# Altium schematic sheet Roseta_Battery.SchDoc
size A4
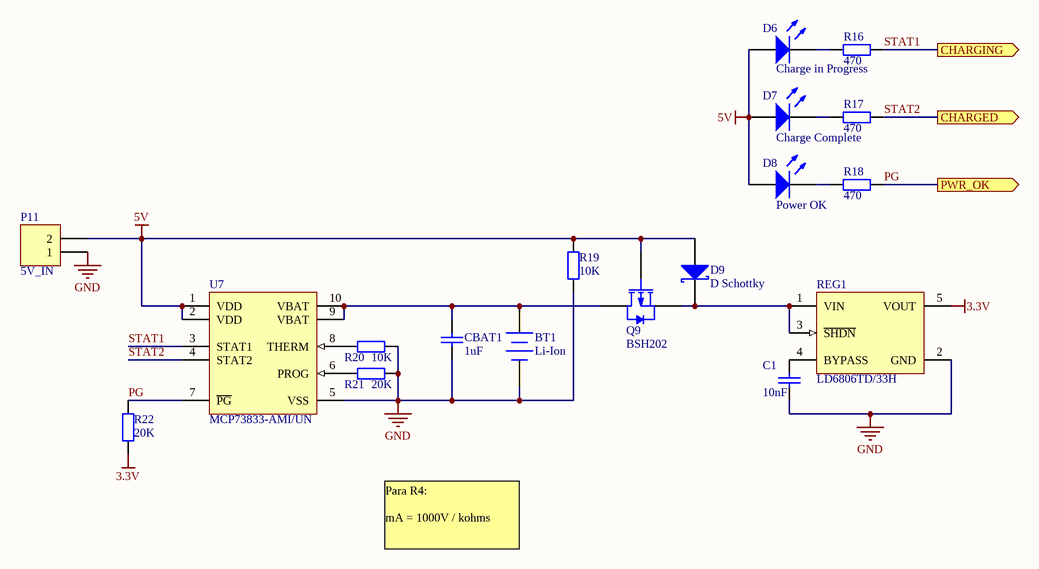
[diagram p0: Roseta_Battery.SchDoc]

## Parts
BT1  Li-Ion  [BAT-2]
C1  value 10nF  [1608[0603]]  (hidden comment: Cap)
CBAT1  value 1uF  [1608[0603]]  (hidden comment: Cap)
D6  Charge in Progress  [2013[0805]]
D7  Charge Complete  [2013[0805]]
D8  Power OK  [2013[0805]]
D9  D Schottky  [SOD123/X.85]
P11  5V_IN  [HDR1X2]
Q9  BSH202  [SOT95P240-3M]
R16  value 470  [1608[0603]]  (hidden comment: Res2)
R17  value 470  [1608[0603]]  (hidden comment: Res2)
R18  value 470  [1608[0603]]  (hidden comment: Res2)
R19  value 10K  [1608[0603]]  (hidden comment: Res2)
R20  value 10K  [1608[0603]]  (hidden comment: Res2)
R21  value 20K  [1608[0603]]  (hidden comment: Res2)
R22  value 20K  [1608[0603]]  (hidden comment: Res2)
REG1  LD6806TD/33H  [SOT-23-OT5_N]
U7  MCP73833-AMI/UN  [MSOP-UN10_N]

## Ports
CHARGED (out), CHARGING (out), PWR_OK (out)

## Nets
3.3V: R22.2 REG1.5(VOUT)
5V: D6.1 D7.1 D8.1 D9.1(A) P11.2 Q9.1(G) R19.1 U7.1(VDD) U7.2(VDD)
GND: BT1.2(-) C1.1 CBAT1.2 P11.1 R19.2 R20.1 R21.1 REG1.2(GND) U7.5(VSS)
PG: R18.2 R22.1 U7.7(~{PG}) ; port PWR_OK
STAT1: R16.2 U7.3(STAT1) ; port CHARGING
STAT2: R17.2 U7.4(STAT2) ; port CHARGED
NetBT1_1: BT1.1(+) CBAT1.1 Q9.3(D) U7.9(VBAT) U7.10(VBAT)
NetC1_2: C1.2 REG1.4(BYPASS)
NetD6_2: D6.2 R16.1
NetD7_2: D7.2 R17.1
NetD8_2: D8.2 R18.1
NetD9_2: D9.2(K) Q9.2(S) REG1.1(VIN) REG1.3(~{SHDN})
NetR20_2: R20.2 U7.8(THERM)
NetR21_2: R21.2 U7.6(PROG)

## Notes on the sheet
- Para R4:
  mA = 1000V / kohms

## Library data of the parts
BT1 = Battery: Multicell Battery; Published: 24-Mar-1999; LatestRevisionDate: 17-Jul-2002; LatestRevisionNote: Re-released for DXP Platform.; PackageReference: BAT-2; Publisher: Altium Limited
C1 CBAT1 = Cap: Capacitor; Published: 8-Jun-2000; LatestRevisionDate: 17-Jul-2002; LatestRevisionNote: Re-released for DXP Platform.; PackageReference: RAD-0.3; Publisher: Altium Limited
D6-D8 = LED SMD (0603)
D9 = D Schottky: Schottky Diode; Published: 8-Jun-2000; LatestRevisionDate: 17-Jul-2002; LatestRevisionNote: Re-released for DXP Platform.; PackageReference: SMB; Publisher: Altium Limited; Code_JEDEC: DO-214-AA
P11 = Header 2: Header, 2-Pin; LatestRevisionDate: 17-Jul-2002; LatestRevisionNote: Re-released for DXP Platform.; Publisher: Altium Limited
Q9 = BSH202: P-channel Enhancement Mode MOSFET; Published: 17-Sep-2003; LatestRevisionDate: 12-Dec-2006; LatestRevisionNote: IPC-7351 Footprint Added.; DatasheetVersion: Aug-1998; PackageVersion: May-1999; PackageReference: SOT23; Publisher: Altium Limited; PackageDescription: 3-Pin SOT-23 Package 0.95 mm Pitch, 2.3 mm Lead Span; ComponentLink1Description: Manufacturer Link; ComponentLink1URL: http://www.semiconductors.philips.com/; ComponentLink2Description: Datasheet; ComponentLink2URL: http://www.semiconductors.philips.com/acrobat/datasheets/BSH202_3.pdf
R16-R22 = Res2: Resistor; Published: 8-Jun-2000; LatestRevisionDate: 17-Jul-2002; LatestRevisionNote: Re-released for DXP Platform.; PackageReference: AXIAL-0.4; Publisher: Altium Limited
REG1 = TC1014-1.8VCT713: 50 mA, 100 mA and 150 mA CMOS LDOs with Active-Low Shutdown and Reference Bypass, 5-Pin SOT-23, Extended Temperature, Tape and Reel; FirstPublished: 29-Jan-2009; DatasheetVersion: revE, Feb-2007; PackageVersion: revBB, Aug-2009; PackageReference: SOT-23-CT5; Publisher: Altium Limited; PackageDescription: 5-Lead Plastic Small Outline Transistor (CT) [SOT-23]; Supplier 1: Digi-Key; Supplier Part Number 1: TC10141.8VCT713TR-ND; Supplier 2: Digi-Key; Supplier Part Number 2: TC10141.8VCT713CT-ND; Supplier 3: Digi-Key; Supplier Part Number 3: TC10141.8VCT713DKR-ND; Supplier 4: Farnell; Supplier Part Number 4: 1331500; Supplier 5: Newark; Supplier Part Number 5: 27C9045; Code_IPC: SOT23-5; ComponentLink1Description: Datasheet; ComponentLink1URL: http://ww1.microchip.com/downloads/en/DeviceDoc/21335e.pdf; ComponentLink2Description: Packaging Specification; ComponentLink2URL: http://www.microchip.com/stellent/groups/techpub_sg/documents/packagingspec/en012702.pdf; ComponentLink3Description: Microchip.com Home; ComponentLink3URL: http://www.microchip.com/
U7 = MCP73833-AMI/UN: Stand-Alone Linear Li-Ion/Li-Polymer Charge Management Controller with Power-Good Output, 4.2V, 10-Pin MSOP, Industrial Temperature; FirstPublished: 29-Jan-2009; LatestRevisionDate: 27-Nov-2009; LatestRevisionNote: Updated to datasheet revision B, May-2009; DatasheetVersion: revB, May-2009; PackageVersion: revBB, Aug-2009; PackageReference: MSOP-UN10; Publisher: Altium Limited; PackageDescription: 10-Lead Plastic Micro Small Outline Package (UN) [MSOP]; Supplier 1: Digi-Key; Supplier Part Number 1: MCP73833-AMI/UN-ND; Supplier 2: Farnell; Supplier Part Number 2: 1332160; Supplier 3: Newark; Supplier Part Number 3: 88K5664; ComponentLink1Description: Datasheet; ComponentLink1URL: http://ww1.microchip.com/downloads/en/DeviceDoc/22005b.pdf; ComponentLink2Description: Packaging Specification; ComponentLink2URL: http://www.microchip.com/stellent/groups/techpub_sg/documents/packagingspec/en012702.pdf; ComponentLink3Description: Microchip.com Home; ComponentLink3URL: http://www.microchip.com/